# Altium schematic sheet ETHERNET.SchDoc: XC7A3G-ETHERNET
size A4; Date: 9 AUG 2026; Engineer: Parsa Malekpour; Revision: 1.0.0; SheetNumber: 11; SheetTotal: 18
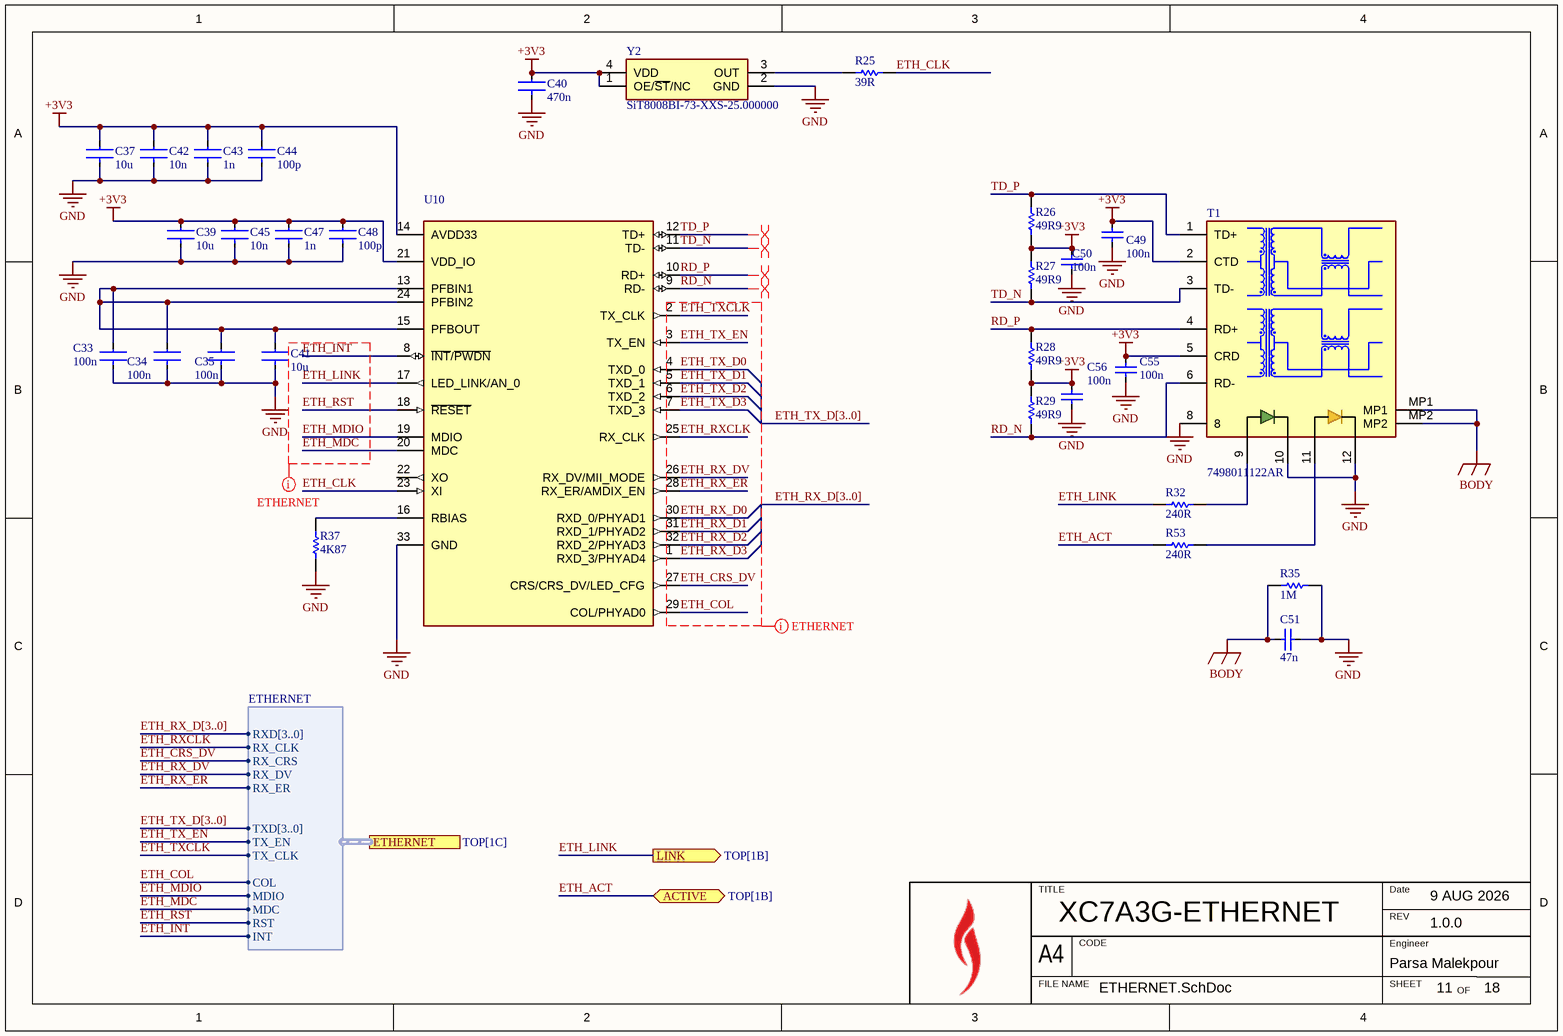
[diagram p0: ETHERNET.SchDoc]

## Parts
C33  value 100n  [FP-C1005-050-0_05-IPC_C]  (hidden comment: C1005X7R1H104K050BB)
C34  value 100n  [FP-C1005-050-0_05-IPC_C]  (hidden comment: C1005X7R1H104K050BB)
C35  value 100n  [FP-C1005-050-0_05-IPC_C]  (hidden comment: C1005X7R1H104K050BB)
C37  value 10u  [FP-C1608-080-0_1-IPC_C]  (hidden comment: C1608JB0J106K080AB)
C39  value 10u  [FP-C1608-080-0_1-IPC_C]  (hidden comment: C1608JB0J106K080AB)
C40  value 470n  [FP-C1005-050-0_05-IPC_C]  (hidden comment: C1005X5R1E474K050BB)
C41  value 10u  [FP-C1608-080-0_1-IPC_C]  (hidden comment: C1608JB0J106K080AB)
C42  value 10n  [FP-C1005-050-0_05-IPC_C]  (hidden comment: C1005X7S2A103K050BB)
C43  value 1n  [FP-C1005-050-0_05-IPC_C]  (hidden comment: C1005C0G2A102J050BC)
C44  value 100p  [FP-C1005-050-0_05-IPC_C]  (hidden comment: C1005C0G1H101J050BA)
C45  value 10n  [FP-C1005-050-0_05-IPC_C]  (hidden comment: C1005X7S2A103K050BB)
C47  value 1n  [FP-C1005-050-0_05-IPC_C]  (hidden comment: C1005C0G2A102J050BC)
C48  value 100p  [FP-C1005-050-0_05-IPC_C]  (hidden comment: C1005C0G1H101J050BA)
C49  value 100n  [FP-C1005-050-0_05-IPC_C]  (hidden comment: C1005X7R1H104K050BB)
C50  value 100n  [FP-C1005-050-0_05-IPC_C]  (hidden comment: C1005X7R1H104K050BB)
C51  value 47n  [FP-C1005-050-0_05-IPC_C]  (hidden comment: C1005X7R1H473K050BB)
C55  value 100n  [FP-C1005-050-0_05-IPC_C]  (hidden comment: C1005X7R1H104K050BB)
C56  value 100n  [FP-C1005-050-0_05-IPC_C]  (hidden comment: C1005X7R1H104K050BB)
R25  value 39R  [RESC1005X40X25LL05T10]  (hidden comment: RC0402FR-0739RL)
R26  value 49R9  [RESC1005X40X25LL05T10]  (hidden comment: RC0402FR-074R99L)
R27  value 49R9  [RESC1005X40X25LL05T10]  (hidden comment: RC0402FR-074R99L)
R28  value 49R9  [RESC1005X40X25LL05T10]  (hidden comment: RC0402FR-074R99L)
R29  value 49R9  [RESC1005X40X25LL05T10]  (hidden comment: RC0402FR-074R99L)
R32  value 240R  [RESC1005X40X25LL05T10]  (hidden comment: RC0402FR-07240RL)
R35  value 1M  [RESC1005X40X25LL05T10]  (hidden comment: RC0402FR-071ML)
R37  value 4K87  [RESC1005X40X25LL05T10]  (hidden comment: RC0402FR-074K87L)
R53  value 240R  [RESC1005X40X25LL05T10]  (hidden comment: RC0402FR-07240RL)
T1  7498011122AR  [7498011122AR]
U10  (no value)  [QFN50P500X500X100-33N-D]
Y2  SiT8008BI-73-XXS-25.000000  [QFN_2016_4pins]

## Ports
ACTIVE (bidir, see TOP[1B]), ETHERNET (harness ETHERNET, see TOP[1C]), LINK (out, see TOP[1B])

## Harnesses
ETHERNET: RXD[3..0], TXD[3..0], TX_EN, TX_CLK, RX_CLK, RX_CRS, RX_DV, COL, RX_ER, MDIO, MDC, RST, INT

## Nets
+3V3: C37.1 C39.1 C40.2 C42.2 C43.2 C44.2 C45.2 C47.2 C48.2 C49.2 C50.2 C55.2 C56.2 R26.1 R27.2 R28.1 R29.2 T1.2(CTD) T1.5(CRD) U10.14(AVDD33) U10.21(VDD_IO) Y2.1(OE/~{ST}/NC) Y2.4(VDD)
BODY: C51.1 R35.1 T1.MP1 T1.MP2
GND: C33.1 C34.1 C35.1 C37.2 C39.2 C40.1 C41.2 C42.1 C43.1 C44.1 C45.1 C47.1 C48.1 C49.1 C50.1 C51.2 C55.1 C56.1 R35.2 R37.1 T1.8 T1.10(K_YELLOW) T1.12(K_GREEN) U10.33(GND) Y2.2(GND)
ETH_ACT: R53.1 ; port ACTIVE
ETH_CLK: R25.2 U10.23(XI)
ETH_COL: U10.29(COL/PHYAD0) ; port ETHERNET.COL
ETH_CRS_DV: U10.27(CRS/CRS_DV/LED_CFG) ; port ETHERNET.RX_CRS
ETH_INT: U10.8(~{INT}/~{PWDN}) ; port ETHERNET.INT
ETH_LINK: R32.1 U10.17(LED_LINK/AN_0) ; port LINK
ETH_MDC: U10.20(MDC) ; port ETHERNET.MDC
ETH_MDIO: U10.19(MDIO) ; port ETHERNET.MDIO
ETH_RST: U10.18(~{RESET}) ; port ETHERNET.RST
ETH_RX_D0: U10.30(RXD_0/PHYAD1)
ETH_RX_D1: U10.31(RXD_1/PHYAD2)
ETH_RX_D2: U10.32(RXD_2/PHYAD3)
ETH_RX_D3: U10.1(RXD_3/PHYAD4)
ETH_RX_DV: U10.26(RX_DV/MII_MODE) ; port ETHERNET.RX_DV
ETH_RX_ER: U10.28(RX_ER/AMDIX_EN) ; port ETHERNET.RX_ER
ETH_RXCLK: U10.25(RX_CLK) ; port ETHERNET.RX_CLK
ETH_TX_D0: U10.4(TXD_0)
ETH_TX_D1: U10.5(TXD_1)
ETH_TX_D2: U10.6(TXD_2)
ETH_TX_D3: U10.7(TXD_3)
ETH_TX_EN: U10.3(TX_EN) ; port ETHERNET.TX_EN
ETH_TXCLK: U10.2(TX_CLK) ; port ETHERNET.TX_CLK
RD_N: R29.1 T1.6(RD-) U10.9(RD-)
RD_P: R28.2 T1.4(RD+) U10.10(RD+)
TD_N: R27.1 T1.3(TD-) U10.11(TD-)
TD_P: R26.2 T1.1(TD+) U10.12(TD+)
NetC33_2: C33.2 C34.2 C35.2 C41.1 U10.13(PFBIN1) U10.15(PFBOUT) U10.24(PFBIN2)
NetR25_1: R25.1 Y2.3(OUT)
NetR32_2: R32.2 T1.9(A_YELLOW)
NetR37_2: R37.2 U10.16(RBIAS)
NetR53_2: R53.2 T1.11(A_GREEN)

Not connected (* = marked no-connect by the designer): U10 22(XO)

## Buses and harness runs
bus ETH_RX_D[3..0]
bus ETH_TX_D[3..0]

## Layout directives
differential pair: RD_N, RD_P, TD_N, TD_P
net class ETHERNET; rule Matched Net Lengths [Delay Tolerance = 100ps]: ETH_COL, ETH_CRS_DV, ETH_INT, ETH_LINK, ETH_MDC, ETH_MDIO, ETH_RST, ETH_RX_D0, ETH_RX_D1, ETH_RX_D2, ETH_RX_D3, ETH_RX_DV, ETH_RX_ER, ETH_RXCLK, ETH_TX_D0, ETH_TX_D1, ETH_TX_D2, ETH_TX_D3, ETH_TX_EN, ETH_TXCLK

## Notes on the sheet
- TITLE
- REV
- Date
- A4
- FILE NAME
- CODE
- SHEET
- Engineer
- OF

## Library data of the parts
C33-C35 = CMP-2000-05393-2: Multilayer Ceramic Capacitors 100nF ±10% 50V X7R SMD 0402; Voltage: 50V; Dielectric Material: Ceramic; Min Operating Temperature: -55°C; Depth: 0.5mm; Radiation Hardening: No; RoHS Compliant: Yes; Voltage Rating (DC): 50V; Lead Free: Lead Free; Resistor Type: Ceramic; Height: 0.5mm; Dielectric: X7R; Thickness: 0.022inch; Case/Package: 0402; Case Code (Metric): 1005; Termination: SMD/SMT; Packaging: Tape and Reel; Max Operating Temperature: 125°C; Mount: Surface Mount; Package Quantity: 1; Width: 0.02inch; Weight: 2.3E-05oz; Voltage Rating: 50V; Tolerance: 10%; Construction: Flat; Case Code (Imperial): 0402; Length: 1mm; REACH SVHC: No SVHC; Series: C; Part Number: C1005X7R1H104K050BB
C37 C39 C41 = CMP-08246-004001-1: Multilayer Ceramic Capacitors 10μF ±10% 6.3V JB SMD 0603; Case Code (Imperial): 0603; Thickness: 0.035inch; Min Operating Temperature: -25°C; Termination: SMD/SMT; Lead Free: Lead Free; Resistor Type: Ceramic; Width: 0.8mm; Voltage Rating (DC): 6.3V; Package Quantity: 4000; Tolerance: 10%; Length: 0.063inch; Series: C; Height: 0.8mm; Max Operating Temperature: 85°C; Mount: Surface Mount; RoHS Compliant: Yes; Voltage Rating: 6.3V; Case Code (Metric): 1608; Dielectric Material: Ceramic; Case/Package: 0603; Packaging: Tape and Reel
C40 = CMP-2000-06003-2: Multilayer Ceramic Capacitors 470nF ±10% 25V X5R SMD 0402; Dissipation Factor: 10%; Case Code (Metric): 1005; RoHS Compliant: Yes; Lead Free: Lead Free; Length: 1mm; Case/Package: 0402; Termination: SMD/SMT; Voltage Rating: 25V; Dielectric Material: Ceramic; Dielectric: X5R; Depth: 0.5mm; Series: C; Voltage: 25V; Tolerance: 10%; Packaging: Tape and Reel; Resistor Type: Ceramic; Min Operating Temperature: -55°C; Width: 0.02inch; Thickness: 500um; Package Quantity: 10000; Case Code (Imperial): 0402; Construction: Flat; Height: 0.5mm; REACH SVHC: No SVHC; Radiation Hardening: No; Weight: 2.3E-05oz; Mount: Surface Mount; Voltage Rating (DC): 25V; Max Operating Temperature: 85°C; Part Number: C1005X5R1E474K050BB
C42 C45 = CMP-08246-005668-1: Multilayer Ceramic Capacitors 10nF ±10% 100V X7S SMD 0402; Dissipation Factor: 5%; Case Code (Imperial): 0402; Packaging: Tape and Reel; Voltage Rating (DC): 100V; Max Operating Temperature: 125°C; Min Operating Temperature: -55°C; Case Code (Metric): 1005; Weight: 2.3E-05oz; Length: 1mm; Width: 0.02inch; Tolerance: 10%; Series: C; Package Quantity: 1; RoHS Compliant: Yes; Voltage: 100V; Resistor Type: Ceramic; Number of Pins: 2; Mount: Surface Mount; Height: 0.5mm; Termination: SMD/SMT; Dielectric: X7S; Dielectric Material: Ceramic; Thickness: 0.022inch; REACH SVHC: No SVHC; Lead Free: Lead Free; Voltage Rating: 100V; Case/Package: 0402; Depth: 0.5mm; Part: *
C43 C47 = CMP-08246-005584-1: Multilayer Ceramic Capacitors 1nF ±5% 100V C0G SMD 0402; Voltage Rating: 100V; Termination: SMD/SMT; Width: 0.5mm; Packaging: Tape and Reel; Max Operating Temperature: 125°C; Length: 0.039inch; Case Code (Metric): 1005; Dielectric: C0G; Height: 0.5mm; Package Quantity: 10000; Weight: 2.3E-05oz; Thickness: 0.022inch; Case/Package: 0402; RoHS Compliant: Yes; Case Code (Imperial): 0402; Min Operating Temperature: -55°C; Mount: Surface Mount; Voltage Rating (DC): 100V; Tolerance: 5%; Part Number: C1005C0G2A102J050BC
C44 C48 = CMP-2000-05991-2: Multilayer Ceramic Capacitors 100pF ±5% 50V C0G SMD 0402; Temperature Coefficient: 30ppm/°C; Packaging: Tape and Reel; Number of Pins: 2; Construction: Flat; Max Operating Temperature: 125°C; Depth: 0.5mm; Radiation Hardening: No; Length: 1mm; Mount: Surface Mount; Thickness: 0.022inch; RoHS Compliant: Yes; Width: 0.5mm; Termination: SMD/SMT; Min Operating Temperature: -55°C; Case/Package: 0402; Tolerance: 5%; Height: 0.5mm; Dielectric: C0G; REACH SVHC: No SVHC; Case Code (Imperial): 0402; Dielectric Material: Ceramic; Voltage Rating: 50V; Package Quantity: 1; Voltage Rating (DC): 50V; Weight: 2.3E-05oz; Series: C; Case Code (Metric): 1005; Voltage: 50V; Lead Free: Lead Free
C49 C50 C55 C56 = C1005X7R1H104K050BB: MLCC 100nF ±10% 50V X7R SMD 0402; Dielectric Material: Ceramic; Voltage: 50V; Min Operating Temperature: -55°C; Depth: 0.5mm; Radiation Hardening: No; RoHS Compliant: Yes; Voltage Rating (DC): 50V; Lead Free: Lead Free; Resistor Type: Ceramic; Height: 0.5mm; Dielectric: X7R; Thickness: 0.022inch; Case/Package: 0402; Case Code (Metric): 1005; Termination: SMD/SMT; Packaging: Tape and Reel; Max Operating Temperature: 125°C; Mount: Surface Mount; Package Quantity: 1; Width: 0.02inch; Weight: 2.3E-05oz; Voltage Rating: 50V; Tolerance: 10%; Construction: Flat; Case Code (Imperial): 0402; Length: 1mm; REACH SVHC: No SVHC; Series: C; Part Number: C1005X7R1H104K050BB
C51 = C1005X7R1H473K050BB: MLCC 47nF ±10% 50V X7R SMD 0402; Dielectric Material: Ceramic; Dissipation Factor: 5%; Weight: 2.3E-05oz; Max Operating Temperature: 125°C; Package Quantity: 1; Width: 0.02inch; Min Operating Temperature: -55°C; Length: 1mm; Dielectric: X7R; Voltage Rating: 50V; Number of Pins: 2; Lead Free: Lead Free; Voltage: 50V; Height: 0.5mm; Case Code (Metric): 1005; Voltage Rating (DC): 50V; Construction: Flat; Termination: SMD/SMT; Case Code (Imperial): 0402; Depth: 0.5mm; Packaging: Tape and Reel; Mount: Surface Mount; Series: C; RoHS Compliant: Yes; Tolerance: 10%; Case/Package: 0402; Thickness: 0.022inch; Radiation Hardening: No; Resistor Type: Ceramic; REACH SVHC: No SVHC; Part Number: C1005X7R1H473K050BB
R25 = RC0402FR-0739RL: Manufacturer: Yageo / Phycomp; Part Number: RC0402FR-0739RL; Parameter 1: *
R26-R29 = RC0402FR-074R99L: Manufacturer: Yageo / Phycomp; Part Number: RC0402FR-074R99L
R32 R53 = RC0402FR-07240RL: 240R 0.063W 1% 0402 (1005 Metric)  SMD; Case-Metric: 1005; Case-EIA: 0402; Power: 0.063 W; Tolerance: 1 %; Technology: SMT; Part Number: RC0402FR-07240RL; Parameter 1: *
R35 = RC0402FR-071ML: Manufacturer: Yageo / Phycomp; Part Number: RC0402FR-071ML
R37 = RC0402FR-074K87L: Manufacturer: Yageo / Phycomp; Part Number: RC0402FR-074K87L
T1 = 7498011122AR: Transformer; Manufacturer_Name: Wurth Elektronik; Datasheet Link: https://www.we-online.com/catalog/datasheet/7498011122AR.pdf; Height: 11mm; Manufacturer_Part_Number: 7498011122AR; Mouser Part Number: 710-7498011122AR; Mouser Price/Stock: https://www.mouser.co.uk/ProductDetail/Wurth-Elektronik/7498011122AR?qs=GBLSl2AkiruAAlB45OgRtA%3D%3D; ComponentLink1Description: Alternative supplier; ComponentLink1URL: https://www.rj45-modularjack.com/sale-4038743-7498011122-smt-rj45-connector-with-10-100base-t-magnetics.html
U10 = TLK106RHBR: Integrated Circuit; Manufacturer_Name: Texas Instruments; Datasheet Link: http://www.ti.com/lit/gpn/tlk106; Height: 1mm; Manufacturer_Part_Number: TLK106RHBR; Mouser Part Number: 595-TLK106RHBR; Mouser Price/Stock: https://www.mouser.co.uk/ProductDetail/Texas-Instruments/TLK106RHBR?qs=1sbE9T7hb3adXa9F43EQXg%3D%3D; Arrow Part Number: TLK106RHBR; Arrow Price/Stock: https://www.arrow.com/en/products/tlk106rhbr/texas-instruments
Y2 = SiT8008BI-73-XXS-25.000000: Crystal or Oscillator; Manufacturer_Name: SiTime; Datasheet Link: https://www.sitime.com/support/resource-library/datasheets/sit8008-datasheet; Height: 0.85mm; Manufacturer_Part_Number: SiT8008BI-73-XXS-25.000000